# Altium schematic sheet TPS22810 2.7...18V 3A Load Switch.SchDoc: TPS22810 2.7...18V 3A Load Switch
size A4; PageSetup: Record=PageOptions|CenterHorizontal=True|CenterVertical=True|PrintScale=1.00|XCorrection=1.00|YCorrection=1.00|PrintKind=1|BorderSize=5000000|LeftOffset=0|BottomOffset=0|Orientation=2|PaperLength=1000|PaperWidth=1000|Scale=100|PaperSource=7|PrintQuality=-4|MediaType=1|DitherType=10|PaperKind=11x17|PrintScaleMode=1
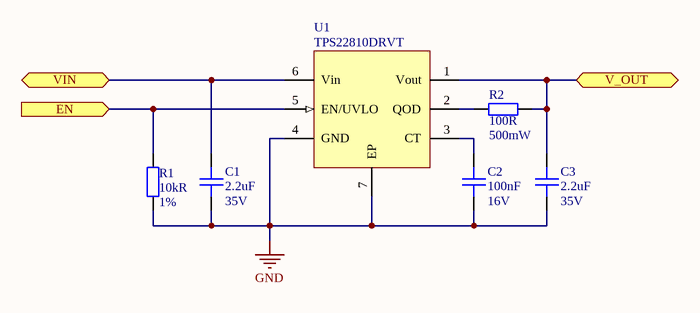
[diagram p0: TPS22810 2.7...18V 3A Load Switch.SchDoc]

## Parts
C1  Capacitance: 2.2uF  Voltage: 35V  [C0603]  (hidden comment: CAP CER 2.2UF 35V X5R 0603)
C2  Capacitance: 100nF  Voltage: 16V  [C0402]  (hidden comment: CAP CER 0.1UF 16V X7R 0402)
C3  Capacitance: 2.2uF  Voltage: 35V  [C0603]  (hidden comment: CAP CER 2.2UF 35V X5R 0603)
R1  Resistance: 10kR  Tolerance: 1%  [R0402]  (hidden comment: RES SMD 10K OHM 1% 1/16W 0402)
R2  Resistance: 100R  Power Rating: 500mW  [R0805]  (hidden comment: RES SMD 100 OHM 1% 1/2W 0805)
U1  TPS22810DRVT  [WSON-6 065]

## Ports
EN (in), V_OUT, VIN

## Nets
GND: C1.2 C2.2 C3.2 R1.2 U1.4(GND) U1.7(EP)
EN: R1.1 U1.5(EN/UVLO) ; port EN
V_OUT: C3.1 R2.2 U1.1(Vout) ; port V_OUT
VIN: C1.1 U1.6(Vin) ; port VIN
NetC2_1: C2.1 U1.3(CT)
NetR2_1: R2.1 U1.2(QOD)

## Notes on the sheet
- Title
- Size:
- Date:
- A4
- Number:
- Time:
- Revision:
- Sheet
- of
- File:

## Library data of the parts
C1 C3 = CAP CER 2.2UF 35V X5R 0603: 2.2µF ±10% 35V Ceramic Capacitor X5R 0603 (1608 Metric); Manufacturer: Murata; Manufacturer Part Number: GRM188R6YA225KA12D; Supplier 1: Digi-Key; Stock 1: 323373; Pricing 1: 1=0.21, 10=0.141, 100=0.0717, 500=0.049, 1000=0.0434 (USD); Mount: Surface Mount; Case/Package: 0603; Weight: 0.000222oz; Case Code (Metric): 1608; Case Code (Imperial): 0603; Material: Ceramic; Min Operating Temperature: -55°C; Max Operating Temperature: 85°C; Packaging: Tape and Reel; Tolerance: 10%; Voltage Rating: 35V; Package Quantity: 4000; Voltage Rating (DC): 35V; Dielectric: X5R; Termination: SMD/SMT; Length: 1.6mm; Height: 0.8mm; Width: 0.8mm; Thickness: 0.035inch; Depth: 0.8mm; Lead Free: Lead Free; REACH SVHC: No SVHC; ComponentLink1URL: https://www.murata.com/~/media/webrenewal/support/library/catalog/products/capacitor/mlcc/c02e.ashx?la=en-us&src-supplier=Digi-Key; ComponentLink1Description: https://www.murata.com/~/media/webrenewal/support/library/catalog/products/capacitor/mlcc/c02e.ashx?la=en-us&src-supplier=Digi-Key; Supplier Part Number 1: 490-7204-1-ND
C2 = CAP CER 0.1UF 16V X7R 0402: 0.1µF ±10% 16V Ceramic Capacitor X7R 0402 (1005 Metric); Manufacturer: Yageo; Manufacturer Part Number: CC0402KRX7R7BB104; Revision: July-2002: Re-released for DXP Platform.; Order: CC0402KRX7R7BB104; Supplier 1: Digi-Key; Stock 1: 25916830; Pricing 1: 1=0.1, 10=0.031, 100=0.0136, 500=0.0097, 1000=0.0077, 2500=0.007, 5000=0.0064 (USD); Mount: Surface Mount; Number of Pins: 2; Case Code (Metric): 1005; Case Code (Imperial): 0402; Min Operating Temperature: -55°C; Max Operating Temperature: 125°C; Tolerance: 10%; Dielectric: X7R; Voltage Rating: 16V; Voltage Rating (DC): 16V; Packaging: Tape and Reel; Package Quantity: 1; Termination: SMD/SMT; Composition: Ceramic; Length: 1mm; Height: 0.5mm; Width: 0.02inch; Thickness: 0.022inch; Depth: 0.5mm; Radiation Hardening: No; REACH SVHC: No SVHC; Lead Free: Lead Free; Halogen Free: Halogen Free; ComponentLink1URL: http://www.yageo.com/documents/recent/UPY-GPHC_X7R_6.3V-to-50V_8.pdf?src-supplier=Avnet+Europe; ComponentLink1Description: http://www.yageo.com/documents/recent/UPY-GPHC_X7R_6.3V-to-50V_8.pdf?src-supplier=Avnet+Europe; ComponentLink2URL: http://www.yageo.com/documents/recent/UPY-GPHC_X7R_6.3V-to-50V_18.pdf?src-supplier=Digi-Key; ComponentLink2Description: http://www.yageo.com/documents/recent/UPY-GPHC_X7R_6.3V-to-50V_18.pdf?src-supplier=Digi-Key; ComponentLink3URL: http://www.yageo.com/documents/recent/UPY-GPHC_X7R_6.3V-to-50V_8.pdf?src-supplier=Avnet; ComponentLink3Description: http://www.yageo.com/documents/recent/UPY-GPHC_X7R_6.3V-to-50V_8.pdf?src-supplier=Avnet; ComponentLink4URL: http://www.yageo.com/documents/recent/UPY-GPHC_X7R_6.3V-to-50V_18.pdf?src-supplier=Mouser; ComponentLink4Description: http://www.yageo.com/documents/recent/UPY-GPHC_X7R_6.3V-to-50V_18.pdf?src-supplier=Mouser; ComponentLink5URL: http://www.farnell.com/datasheets/2167236.pdf?src-supplier=Element14; ComponentLink5Description: http://www.farnell.com/datasheets/2167236.pdf?src-supplier=Element14; ComponentLink6URL: http://www.farnell.com/datasheets/1489800.pdf?src-supplier=Element14; ComponentLink6Description: http://www.farnell.com/datasheets/1489800.pdf?src-supplier=Element14; Supplier Part Number 1: 311-1338-1-ND
R1 = RES SMD 10K OHM 1% 1/16W 0402: 10 kOhms ±1% 0.063W, 1/16W Chip Resistor 0402 (1005 Metric) Moisture Resistant Thick Film; Manufacturer: Yageo; Manufacturer Part Number: RC0402FR-0710KP; Temperature Coefficient: 150ppm/°C; Max Power Dissipation: 63mW; Supplier 1: Digi-Key; Stock 1: 839368; Pricing 1: 1=0.1, 10=0.035, 100=0.014, 1000=0.0063, 2500=0.0055, 5000=0.0045 (USD); Case Code (Imperial): 0402; Case Code (Metric): 1005; Min Operating Temperature: -55°C; Max Operating Temperature: 155°C; Composition: Thick Film; Packaging: Tape and Reel; Number of Terminations: 2; Length: 0.039inch; Height: 0.016inch; Width: 0.02inch; ComponentLink1URL: http://www.yageo.com/NewPortal/yageodocoutput?fileName=/pdf/R-Chip/PYu-RC_51_RoHS_P_0.pdf&src-supplier=Digi-Key; ComponentLink1Description: http://www.yageo.com/NewPortal/yageodocoutput?fileName=/pdf/R-Chip/PYu-RC_51_RoHS_P_0.pdf&src-supplier=Digi-Key; Supplier Part Number 1: YAG1249CT-ND; Case/Package: 0402; Features: Moisture Resistant; Mount: Surface Mount
R2 = RES SMD 100 OHM 1% 1/2W 0805: 100 Ohms ±1% 0.5W, 1/2W Chip Resistor 0805 (2012 Metric) Automotive AEC-Q200, Pulse Withstanding Thick Film; Manufacturer: Panasonic; Manufacturer Part Number: ERJ-P6WF1000V; Voltage Rating: 150V; Temperature Coefficient: 200ppm/°C; Supplier 1: Digi-Key; Stock 1: 36332; Pricing 1: 1=0.54, 10=0.412, 100=0.1731, 1000=0.0955, 2500=0.0896 (USD); Case/Package: 0805; Case Code (Metric): 2012; Case Code (Imperial): 0805; Contact Plating: Tin; Min Operating Temperature: -55°C; Max Operating Temperature: 155°C; Tolerance: 1%; Packaging: Cut Tape; Composition: Thick Film; Number of Terminations: 2; Termination: Flat; Max Power Dissipation: 500mW; Voltage Rating (DC): 150V; Features: Automotive AEC-Q200; Length: 0.079inch; Height: 0.03inch; Width: 0.049inch; Depth: 1.25mm; REACH SVHC: No SVHC; ComponentLink1URL: http://industrial.panasonic.com/www-data/pdf/AOA0000/AOA0000CE4.pdf?src-supplier=Avnet; ComponentLink1Description: http://industrial.panasonic.com/www-data/pdf/AOA0000/AOA0000CE4.pdf?src-supplier=Avnet; ComponentLink2URL: http://www.farnell.com/datasheets/1790600.pdf?src-supplier=Element14; ComponentLink2Description: http://www.farnell.com/datasheets/1790600.pdf?src-supplier=Element14; ComponentLink3URL: https://www.distrelec.biz/Web/Downloads/_t/ds/ERJP-series_eng_tds.pdf?mime=application%2Fpdf&src-supplier=Distrelec; ComponentLink3Description: https://www.distrelec.biz/Web/Downloads/_t/ds/ERJP-series_eng_tds.pdf?mime=application%2Fpdf&src-supplier=Distrelec; Supplier Part Number 1: P16873CT-ND; Mount: Surface Mount
U1 = IC TPS22810DRVT PWR SWITCH N-CHAN 1:1 6WSON: TPS22810, 2.7-18-V, 79-mOhm On-Resistance Load Switch With Thermal Protection; Manufacturer: Texas Instruments; Number of Channels: 1; Interface: On/Off; Fault Protection: Over Temperature; Output Configuration: High Side; Max Output Current: 3A; Supplier 1: Digi-Key; Manufacturer Part Number: TPS22810DRVT; Stock 1: 5029; Pricing 1: 1=0.66, 10=0.581, 25=0.5456, 100=0.4136 (USD); Min Operating Temperature: -40°C; Max Operating Temperature: 105°C; Packaging: Tape and Reel; Number of Outputs: 1; ComponentLink1URL: http://www.ti.com/lit/ds/symlink/tps22810.pdf?src-supplier=Digi-Key; ComponentLink1Description: http://www.ti.com/lit/ds/symlink/tps22810.pdf?src-supplier=Digi-Key; ComponentLink2URL: http://www.ti.com/general/docs/lit/getliterature.tsp?genericPartNumber=TPS22810&fileType=pdf&src-supplier=Farnell; ComponentLink2Description: http://www.ti.com/general/docs/lit/getliterature.tsp?genericPartNumber=TPS22810&fileType=pdf&src-supplier=Farnell; Supplier Part Number 1: 296-46947-1-ND; Mount: Surface Mount